# EAGLE design Electronic Power System EV1 (EAGLE 7.2.0)
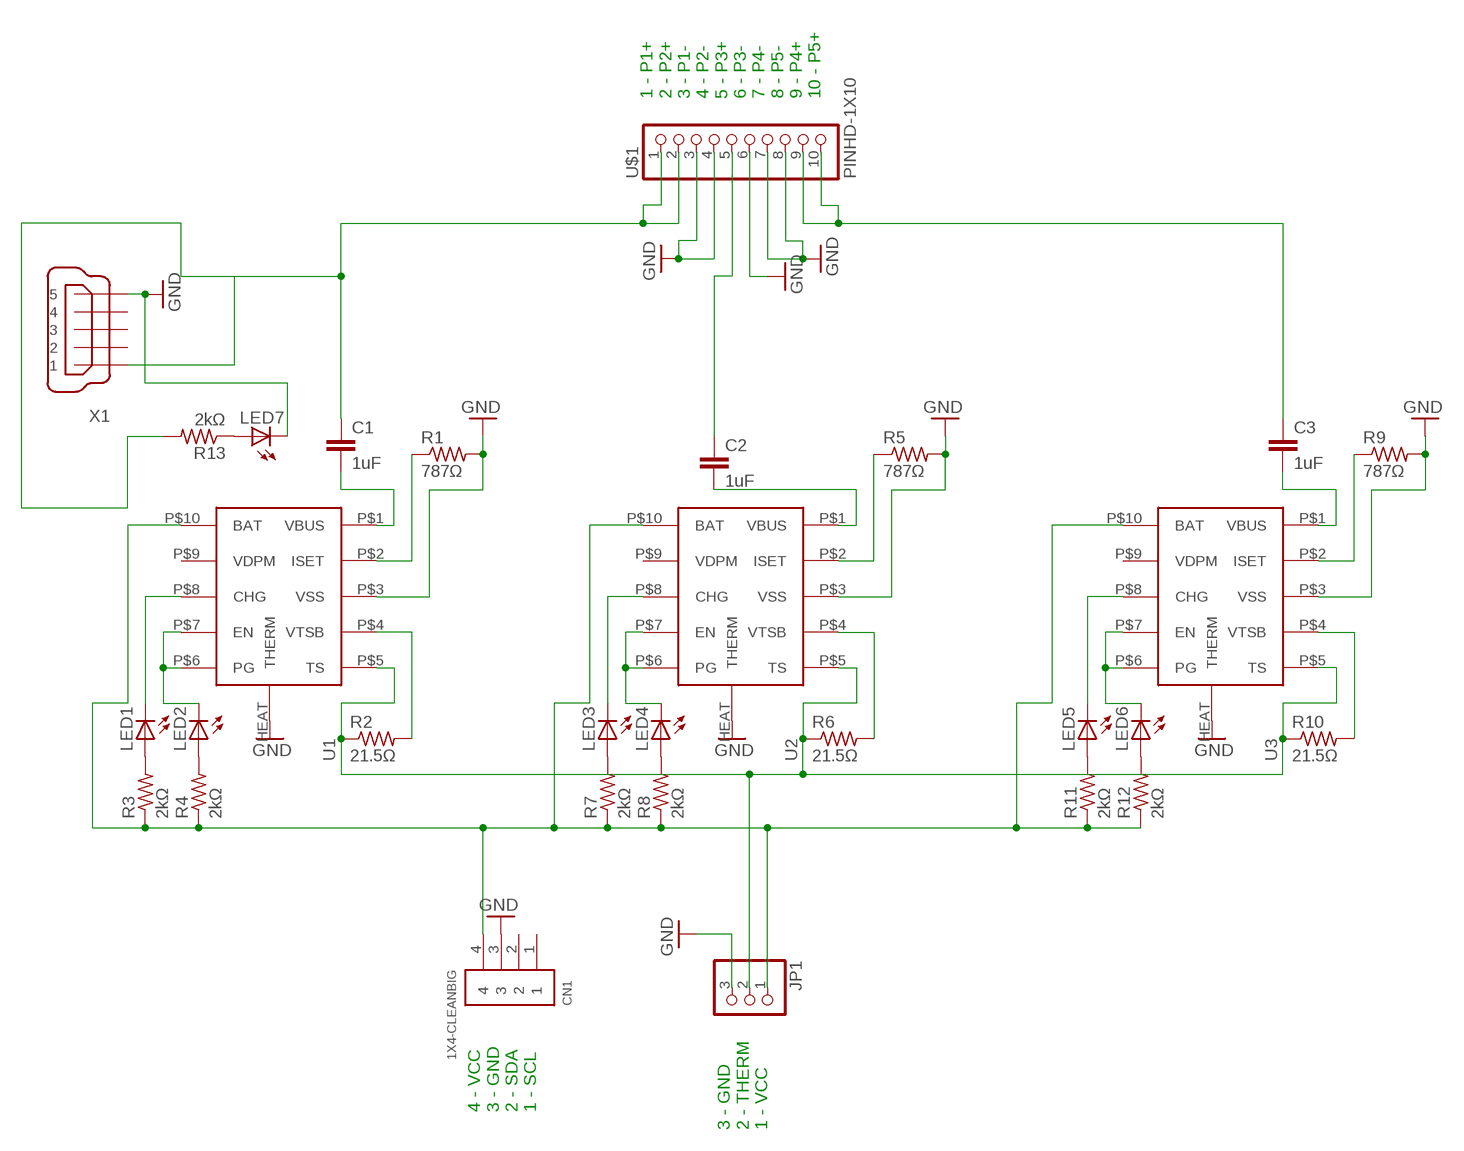
[diagram p0: schematic, sheet 1]

## Parts
C1  1uF  C-EUC0805  [C0805]
C2  1uF  C-EUC0805  [C0805]
C3  1uF  C-EUC0805  [C0805]
CN1  1X4-CLEANBIG  [1X04-CLEANBIG]
JP1  PINHD-1X3  [1X03]
LED1  LEDCHIPLED_0805  [CHIPLED_0805]
LED2  LEDCHIPLED_0805  [CHIPLED_0805]
LED3  LEDCHIPLED_0805  [CHIPLED_0805]
LED4  LEDCHIPLED_0805  [CHIPLED_0805]
LED5  LEDCHIPLED_0805  [CHIPLED_0805]
LED6  LEDCHIPLED_0805  [CHIPLED_0805]
LED7  LEDCHIPLED_0805  [CHIPLED_0805]
R1  787Ω  R-US_R0805  [R0805]
R2  21.5Ω  R-US_R0805  [R0805]
R3  2kΩ  R-US_R0805  [R0805]
R4  2kΩ  R-US_R0805  [R0805]
R5  787Ω  R-US_R0805  [R0805]
R6  21.5Ω  R-US_R0805  [R0805]
R7  2kΩ  R-US_R0805  [R0805]
R8  2kΩ  R-US_R0805  [R0805]
R9  787Ω  R-US_R0805  [R0805]
R10  21.5Ω  R-US_R0805  [R0805]
R11  2kΩ  R-US_R0805  [R0805]
R12  2kΩ  R-US_R0805  [R0805]
R13  2kΩ  R-US_R0805  [R0805]
U1  BQ24210  [BQ24210]
U2  BQ24210  [BQ24210]
U3  BQ24210  [BQ24210]
U$1  PINHD-1X10  [1X10-BIG]
X1  MINI-USB-UX60A-MB-5ST  [UX60A-MB-5ST]

## Nets
GND: CN1.3 JP1.3 LED7.C R1.2 R5.2 R9.2 U1.HEAT(THERM) U1.P$3(VSS) U2.HEAT(THERM) U2.P$3(VSS) U3.HEAT(THERM) U3.P$3(VSS) U$1.3 U$1.4 U$1.6 U$1.7 U$1.8 X1.5
N$1: LED1.C U1.P$8(CHG)
N$2: R10.2 U3.P$4(VTSB)
N$3: C1.2 U1.P$1(VBUS)
N$4: C2.2 U2.P$1(VBUS)
N$5: R6.2 U2.P$4(VTSB)
N$6: CN1.4 JP1.1 R3.1 R4.1 R7.1 R8.1 R11.1 R12.1 U1.P$10(BAT) U2.P$10(BAT) U3.P$10(BAT)
N$7: C3.2 U3.P$1(VBUS)
N$9: R2.2 U1.P$4(VTSB)
N$10: LED2.C U1.P$6(PG) U1.P$7(EN)
N$11: LED4.C U2.P$6(PG) U2.P$7(EN)
N$12: LED6.C U3.P$6(PG) U3.P$7(EN)
N$13: R5.1 U2.P$2(ISET)
N$14: R1.1 U1.P$2(ISET)
N$15: R9.1 U3.P$2(ISET)
N$16: LED3.C U2.P$8(CHG)
N$17: LED1.A R3.2
N$18: LED5.C U3.P$8(CHG)
N$19: C1.1 R13.2 U$1.1 U$1.2 X1.1
N$20: LED2.A R4.2
N$21: LED3.A R7.2
N$22: LED4.A R8.2
N$23: LED5.A R11.2
N$24: LED6.A R12.2
N$28: C2.1 U$1.5
N$29: JP1.2 R2.1 R6.1 R10.1 U1.P$5(TS) U2.P$5(TS) U3.P$5(TS)
N$32: C3.1 U$1.9 U$1.10
N$41: LED7.A R13.1
Unconnected: CN1.1 CN1.2 U1.P$9(VDPM) U2.P$9(VDPM) U3.P$9(VDPM) X1.2 X1.3 X1.4

## Notes on the sheet
- 1 - P1+
  2 - P2+
  3 - P1-
  4 - P2-
  5 - P3+
  6 - P3-
  7 - P4-
  8 - P5-
  9 - P4+
  10 - P5+
- 4 - VCC
  3 - GND
  2 - SDA
  1 - SCL
- 3 - GND
  2 - THERM
  1 - VCC

## Library data of the parts
C1-C3 = rcl:C-EU: CAPACITOR, European symbol
CN1 = adafruit:1X4: 4-pin connector
JP1 = adafruit:PINHD-1X3: PIN HEADER
LED1-LED7 = adafruit:LED: LED OSRAM: - CHIPLED LG R971, LG N971, LY N971, LG Q971, LY Q971, LO R971, LY R971 LH N974, LH R974 LS Q976, LO Q976, LY Q976 LO Q996 - Hyper CHIPLED LW Q18S LB Q993, LB Q99A, LB R99A - SideLED LS A670, LO A670, LY A670, LG A670, LP A670 LB A673, LV A673, LT A673, LW A673 LH A674 LY A675 LS A676, LA A676, LO A676, LY A676, LW A676 LS A679, LY A679, LG A679 - Hyper Micro SIDELED® LS Y876, LA Y876, LO Y876, LY Y876 LT Y87S - SmartLED LW L88C, LW L88S LB L89C, LB L89S, LG L890 LS L89K, LO L89K, LY L89K LS L896, LA L896, LO L896, LY L896 - TOPLED LS T670, LO T670, LY T670, LG T670, LP T670 LSG T670, LSP T670, LSY T670, LOP T670, LYG T670 LG T671, LOG T671, LSG T671 LB T673, LV T673, LT T673, LW T673 LH T674 LS T676, LA T676, LO T676, LY T676, LB T676, LH T676, LSB T676, LW T676 LB T67C, LV T67C, LT T67C, LS T67K, LO T67K, LY T67K, LW E67C LS E67B, LA E67B, LO E67B, LY E67B, LB E67C, LV E67C, LT E67C LW T67C LS T679, LY T679, LG T679 LS T770, LO T770, LY T770, LG T770, LP T770 LB T773, LV T773, LT T773, LW T773 LH T774 LS E675, LA E675, LY E675, LS T675 LS T776, LA T776, LO T776, LY T776, LB T776 LHGB T686 LT T68C, LB T68C - Hyper Mini TOPLED® LB M676 - Mini TOPLED Santana® LG M470 LS M47K, LO M47K, LY M47K Source: http://www.osram.convergy.de/
R1-R13 = adafruit:R-US_: RESISTOR, American symbol
U1-U3 = satellite:BQ24210: Texas Instruments Solar Li-Ion Battery Charger Input Voltage: 3.5V - 18V Output Voltage: 4.2V @ 800mAh
U$1 = adafruit:PINHD-1X10: Pin header 1x10 0.1" spacing With round pins
X1 = con-hirose:MINI-USB-: MINI USB Connector Source: http://www.hirose.co.jp/cataloge_hp/e24000019.pdf; OC_FARNELL: unknown; OC_NEWARK: unknown

## Net classes
0 default: clearance 0.205 mm

## Board
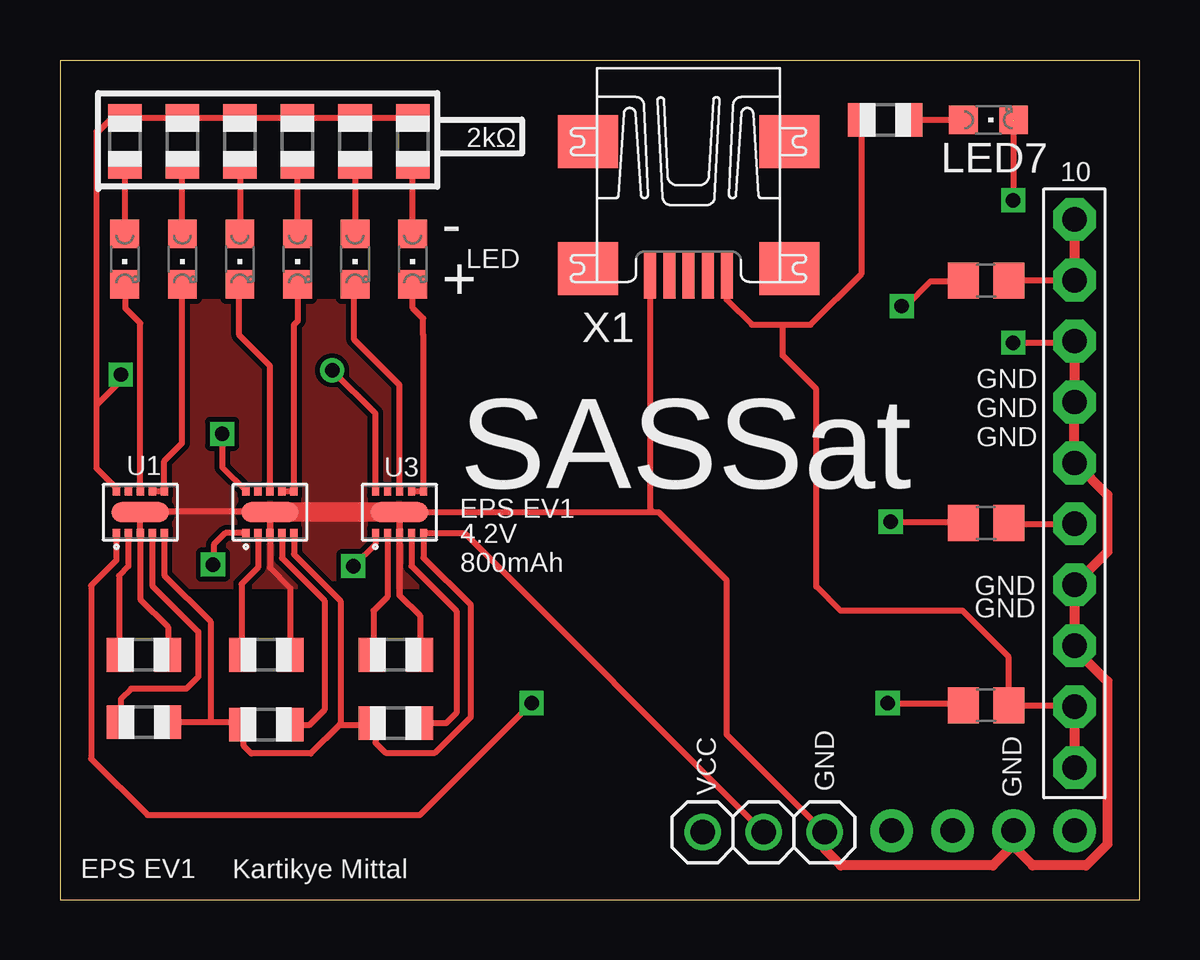
[diagram p1: board, top side]
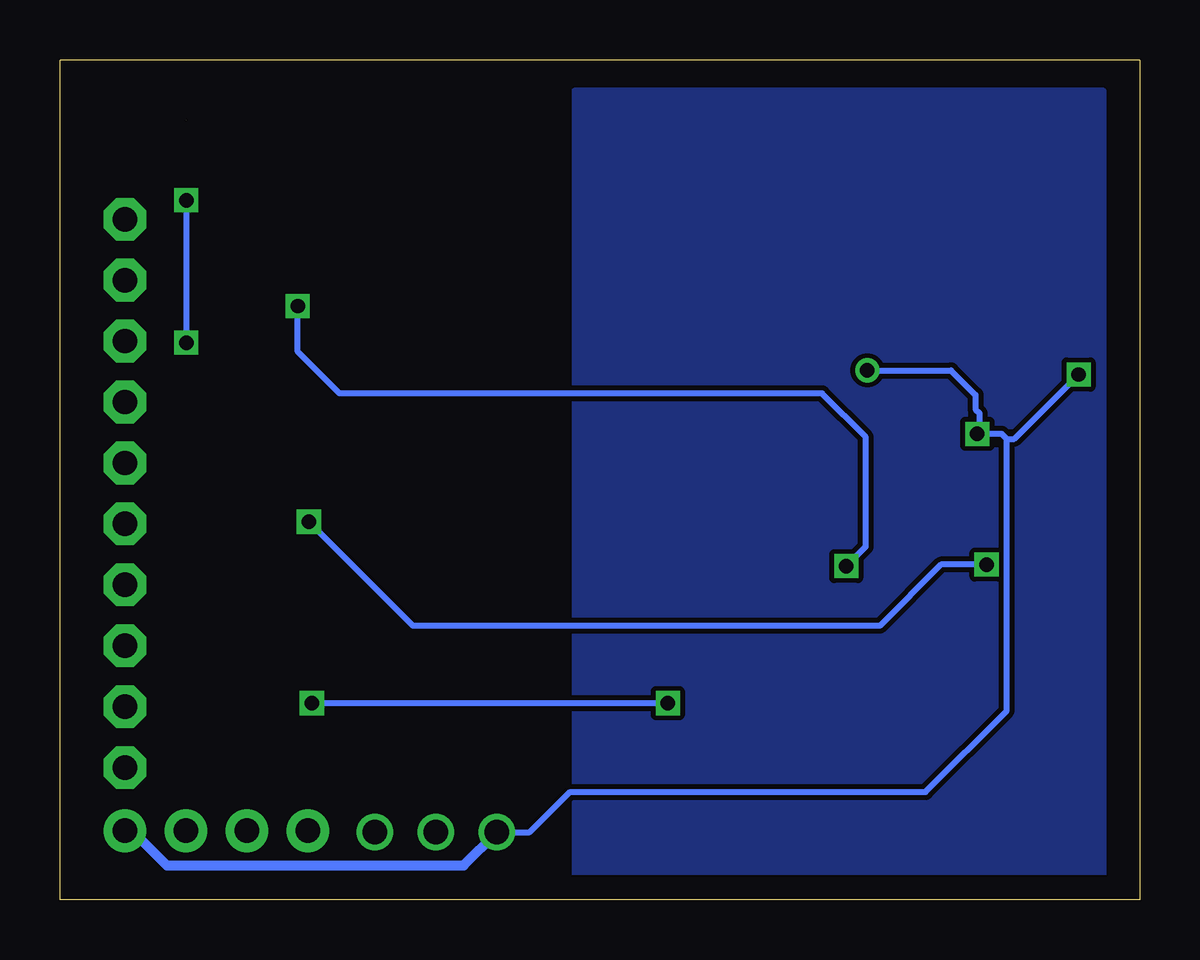
[diagram p2: board, bottom side, seen from below]

Size 45 x 35 mm. Coordinates in mm from the lower left corner, seen from the top.
Outline: 0,0 45,0 45,35 0,35 0,0
Copper layers (1*16): Top 0.035mm / dielectric 1.5mm / Bottom 0.035mm
Design rules "default *": minimum track width 7mil, minimum drill 12mil, track to track 7mil, track to pad 7mil, pad to pad 7mil, via to via 7mil, smd to smd 7mil, copper to edge 40mil, drill to drill 8mil, minimum pad ring 10mil, minimum via ring 8mil, stop-mask expansion 4mil, vias tented up to drill 0mil, thermal gap 10mil

### Footprints (pad centres in the part's own frame; a part is rotated, then mirrored left to right if it is on the bottom)
C0805 = smd 1.3 x 1.5: 1 -0.95,0; 2 0.95,0
1X04-CLEANBIG = drill 1.016 pad 1.778: 1 -3.81,0; 2 -1.27,0; 3 1.27,0; 4 3.81,0
1X03 = drill 1.016: 1 -2.54,0; 2 0,0; 3 2.54,0
CHIPLED_0805 = smd 1.2 x 1.2: A 0,-1.05; C 0,1.05
R0805 = smd 1.1 x 1.4: 1 -1,0; 2 1,0
BQ24210 = smd 2.4 x 0.84: HEAT 1.15,-1.05 | smd 0.3 x 0.35: P$1 0.15,-1.925; P$2 0.65,-1.925; P$3 1.15,-1.925; P$4 1.65,-1.925; P$5 2.15,-1.925; P$6 2.15,-0.175; P$7 1.65,-0.175; P$8 1.15,-0.175; P$9 0.65,-0.175; P$10 0.15,-0.175
1X10-BIG = drill 1.016 pad 1.778 octagon: 1 -11.43,0; 2 -8.89,0; 3 -6.35,0; 4 -3.81,0; 5 -1.27,0; 6 1.27,0; 7 3.81,0; 8 6.35,0; 9 8.89,0; 10 11.43,0
UX60A-MB-5ST = smd 2 x 0.5: 1 2.25,1.6; 2 2.25,0.8; 3 2.25,0; 4 2.25,-0.8; 5 2.25,-1.6 | smd 2.2 x 2.5: M1 -3.3,-4.2; M2 -3.3,4.2; M3 2,4.2; M4 2,-4.2

### Placement (x,y rotation side)
C1  38.6,8.1 180 top
C2  38.6,15.7 180 top
C3  38.6,25.8 180 top
CN1  38.48,2.87 0 top
JP1  29.33,2.81 0 top
LED1  2.7,26.7 180 top
LED2  5.1,26.7 180 top
LED3  7.5,26.7 180 top
LED4  9.9,26.7 180 top
LED5  12.3,26.7 180 top
LED6  14.7,26.7 180 top
LED7  38.7,32.5 270 top
R1  3.5,10.2 0 top
R2  3.5,7.4 180 top
R3  2.7,31.6 270 top
R4  5.1,31.6 270 top
R5  8.6,10.2 0 top
R6  8.6,7.3 0 top
R7  7.5,31.6 270 top
R8  9.9,31.6 270 top
R9  14,10.2 0 top
R10  14,7.35 0 top
R11  12.3,31.6 270 top
R12  14.7,31.6 270 top
R13  34.4,32.5 180 top
U1  2.2,17.2 0 top
U2  7.6,17.2 0 top
U3  13,17.2 0 top
U$1  42.29,16.93 90 top
X1  26.2,28.3 270 top

### Tracks (layer width: path | path; a pad name or v marks a point on that pad's centre or on a via)
GND  (via drill 0.6)  (1 unrouted)
  Top 0.254: U2.HEAT U2.P$3 | 4.54,10.2 R1.2 4.5,11.36 3.35,12.51 U1.P$3 U1.HEAT 3.38,16.18 8.57,16.18 8.75,16 U2.P$3 | 15.18,10.18 R9.2 15,11.84 | U3.HEAT U3.P$3 14.15,12.69 15,11.84 | R5.2 9.6,12.99 8.75,13.84 U2.P$3 | U$1.8 42.29,23.21 v39.74,23.21 | JP1.3 27.8,6.87 27.8,13.3 24.95,16.15 24.73,16.15 | 39.74,32.5 v39.74,29.15 | 15,11.84 15,11.85 14.16,12.69 14.16,16.09 14.22,16.15 24.73,16.15 | 24.73,16.15 24.6,16.27 X1.5
  Top 0.406: U$1.8 U$1.7 U$1.6 42.34,18.2 43.66,16.88 43.66,14.49 U$1.4 U$1.3 42.29,10.47 43.66,9.1 43.66,2.31 42.77,1.43 40.55,1.43 39.77,2.2 39.77,2.84 CN1.3 39.74,2.28 38.89,1.43 32.55,1.43 31.89,2.09 31.89,2.79 JP1.3
  Top 0.813: U3.HEAT U2.HEAT
  Bottom 0.254: v39.74,29.15 v39.74,23.21
  pour Top: 4.31,16.36 4.42,16.36 4.42,18.32 4.42,18.44 5.04,19.05 5.04,24.82 5.14,24.93 15.25,24.93 15.25,13.06 4.72,13.06 4.31,13.47 4.31,16.15
N$1
  Top 0.254: U1.P$8 3.35,24.02 2.74,24.64 2.74,25.61 LED1.C
N$2
  Top 0.254: U3.P$4 14.65,13.9 16.52,12.03 16.52,7.78 16.1,7.35 R10.2
N$3  (via drill 0.6)
  Top 0.254: U1.P$1 2.35,14.14 1.3,13.09 1.3,5.88 3.65,3.52 15,3.52 v19.66,8.19 | v34.5,8.19 37.56,8.19 C1.2
  Bottom 0.254: v19.66,8.19 v34.5,8.19
N$4  (via drill 0.6)
  Top 0.254: 37.18,15.75 C2.2 37.6,15.75 v34.62,15.75 | U2.P$1 6.89,15.28 6.41,14.8 6.41,14 v6.38,13.96
  Bottom 0.254: v6.38,13.96 8.28,13.96 10.82,11.41 30.29,11.41 v34.62,15.75
N$5
  Top 0.254: R6.2 9.69,7.26 10.38,7.26 11.03,7.91 11.03,12.46 9.25,14.24 U2.P$4
N$6  (via drill 0.6)
  Top 0.254: R12.1 R11.1 R8.1 R7.1 R4.1 R3.1 2.69,32.61 2.19,32.61 1.59,32.01 1.52,32.01 1.52,20.61 | U1.P$10 2.35,17.15 1.52,17.98 1.52,20.61 | v6.76,19.41 6.76,18.01 U2.P$10 | U3.P$10 13.15,20.26 v11.35,22.06 | v2.54,21.89 2.54,21.62 1.52,20.61
  Top 0.406: 7.49,32.57 R7.1
  Bottom 0.254: v11.35,22.06 7.86,22.06 6.84,21.04 6.84,20.44 6.67,20.27 6.67,19.5 v6.76,19.41 5.75,19.41 5.54,19.2 | JP1.1 25.42,2.81 23.74,4.49 8.93,4.49 5.54,7.88 5.54,19.2 | 5.54,19.2 5.22,19.2 v2.54,21.89
  Bottom 0.406: CN1.4 41.99,2.87 40.55,1.43 28.17,1.43 JP1.1
N$7  (via drill 0.6)
  Top 0.254: U3.P$1 13.15,14.82 v12.22,13.9 | v35.09,24.74 35.25,24.74 36.29,25.77 37.62,25.77 C3.2
  Bottom 0.254: v12.22,13.9 11.41,14.71 11.41,19.27 13.24,21.1 33.35,21.1 35.09,22.84 v35.09,24.74
N$9
  Top 0.254: U1.P$4 3.85,13.07 5.76,11.16 5.76,9.29 5.26,8.79 2.96,8.79 2.54,8.36 2.54,7.44 R2.2
N$10
  Top 0.254: LED2.C 5.09,25.62 5.09,19.02 4.35,18.29 U1.P$6 U1.P$7
N$11
  Top 0.254: 9.75,17.01 U2.P$6 | U2.P$6 9.75,23.96 9.93,24.14 9.93,25.62 LED4.C | U2.P$7 U2.P$6
N$12
  Top 0.254: 14.65,25.65 LED6.C 14.7,24.66 15.14,24.23 15.14,23.54 15.15,23.52 U3.P$6 U3.P$7
N$13
  Top 0.254: R5.1 7.56,10.24 7.56,13.15 8.25,13.84 U2.P$2
N$14
  Top 0.254: U1.P$2 2.85,13.89 2.46,13.5 2.46,10.24 R1.1 2.51,10.21
N$15
  Top 0.254: U3.P$2 13.65,12.62 13.06,12.04 13.06,10.26 R9.1
N$16
  Top 0.254: 8.76,17.02 U2.P$8 8.75,22.25 7.47,23.52 7.47,25.62 LED3.C
N$17
  Top 0.254: R3.2 LED1.A
N$18
  Top 0.254: U3.P$8 14.15,21.45 12.26,23.34 12.26,25.61 LED5.C
N$19
  Top 0.254: U$1.2 42.23,8.1 C1.1 39.55,10.11 37.62,12.04 32.54,12.04 31.52,13.05 31.52,21.27 30.12,22.68 30.12,23.96 | R13.2 33.4,26.07 31.29,23.96 30.12,23.96 | X1.1 27.8,25 28.84,23.96 30.12,23.96
  Top 0.406: U$1.2 U$1.1
N$20
  Top 0.254: LED2.A R4.2
N$21
  Top 0.254: R7.2 LED3.A
N$22
  Top 0.254: LED4.A R8.2
N$23
  Top 0.254: R11.2 LED5.A
N$24
  Top 0.254: LED6.A R12.2
N$28
  Top 0.254: 39.17,15.66 U$1.5
  Top 0.406: 39.17,15.66 C2.1
N$29
  Top 0.254: 7.58,7.38 R6.1 | R6.1 7.66,7.29 7.66,6.4 7.97,6.09 10.45,6.09 11.65,7.29 | 11.65,7.29 13.09,7.29 R10.1 13.15,6.87 13.15,6.53 13.56,6.12 15.62,6.12 17.12,7.62 17.12,12.28 15.15,14.25 U3.P$5 16.86,15.28 JP1.2 | 11.65,7.29 11.69,7.33 11.69,12.45 9.75,14.39 U2.P$5 | R2.1 6.36,7.4 | 6.36,7.4 7.5,7.4 R6.1 | U1.P$5 4.35,13.51 6.28,11.59 6.28,7.49 6.36,7.4
N$32
  Top 0.254: 39.55,25.82 U$1.9
  Top 0.406: U$1.10 U$1.9 | 39.55,25.82 C3.1
N$41
  Top 0.254: LED7.A R13.1
N$42
  pour Bottom: 1.5,33.71 23.56,33.71 23.56,1.07 1.49,1.07 1.49,33.59

### Text on the board
tNames: 2kΩ | 10 | - | LED | + | GND | GND | GND | U1 | U3 | SASSat | EPS EV1 | 4.2V / 800mAh | GND | GND | VCC | GND | GND | EPS EV1 | Kartikye Mittal